# EAGLE board MusselGapeTracker_RevB (EAGLE 7.5.0), part 1 of 2
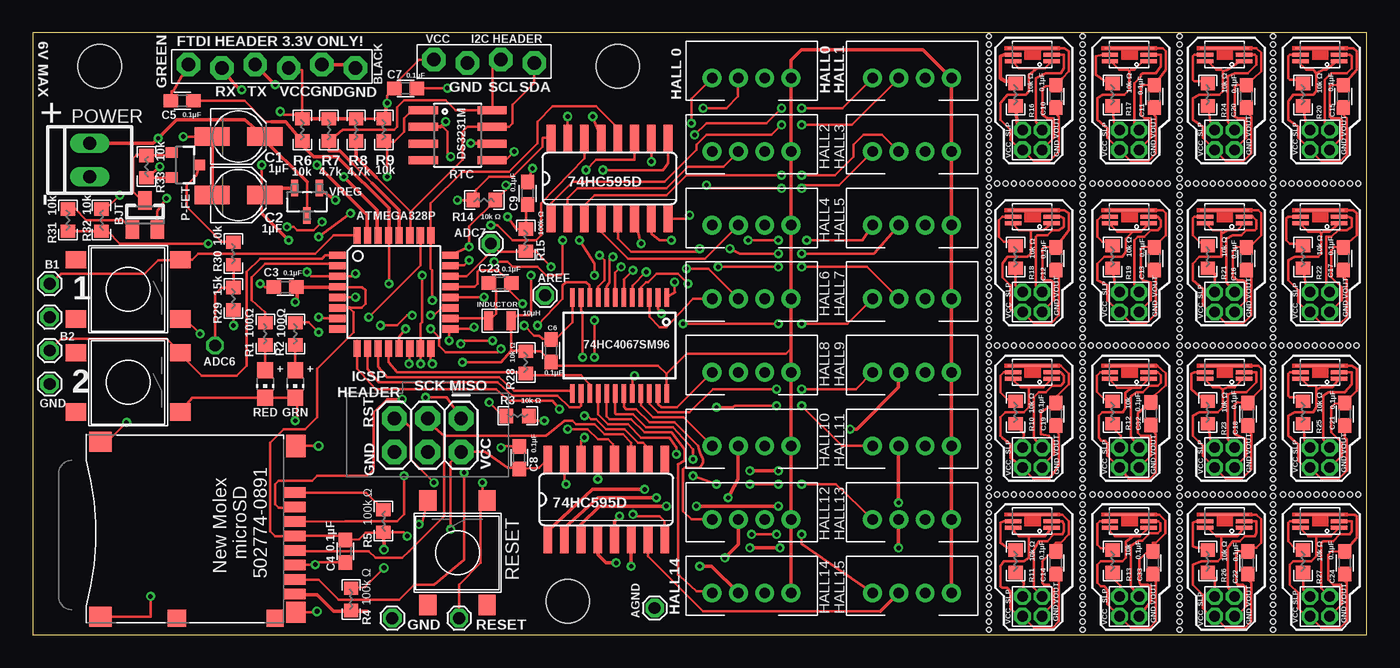
[diagram p1: board, top side]
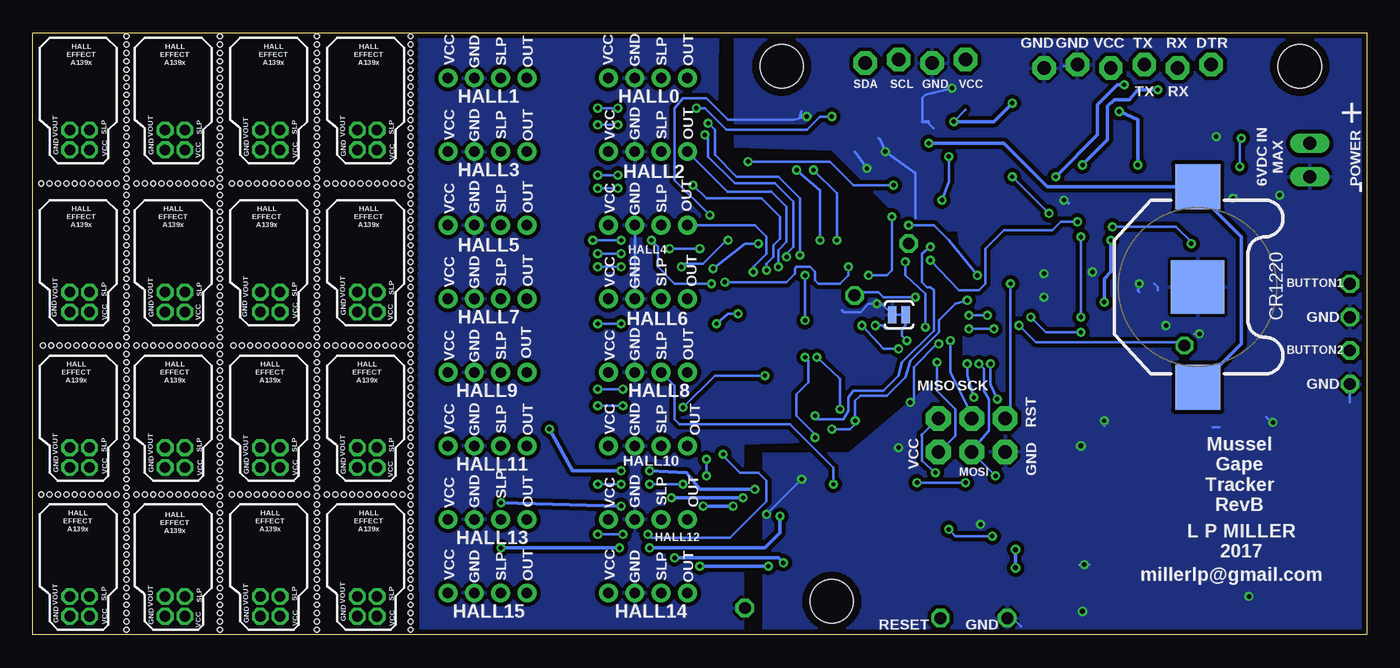
[diagram p2: board, bottom side, seen from below]

Size 101.35 x 45.72 mm. Coordinates in mm from the lower left corner, seen from the top.
Outline: 0,0 101.35,0 101.35,45.72 0,45.72 0,0
Copper layers (1*16): Top 0.0356mm / dielectric 1.5011mm / Bottom 0.0356mm
Design rules "LaenPCBOrder *": minimum track width 6mil, minimum drill 13mil, track to track 6mil, track to pad 6mil, pad to pad 6mil, via to via 6mil, smd to smd 6mil, copper to edge 15mil, drill to drill 6mil, minimum pad ring 7mil, minimum via ring 7mil, stop-mask expansion 3mil, vias tented up to drill 30mil, thermal gap 10mil
Holes 0.38 mm at 72.64,0.38 72.64,1.02 72.64,1.65 72.64,2.29 72.64,2.92 72.64,3.56 72.64,4.19 72.64,4.83 72.64,5.46 72.64,6.1 72.64,6.73 72.64,7.37 72.64,8 72.64,8.64 72.64,9.27 72.64,9.91 72.64,10.54 72.64,11.18 72.64,11.81 72.64,12.45 72.64,13.08 72.64,13.72 72.64,14.35 72.64,14.99 72.64,15.62 72.64,16.26 72.64,16.89 72.64,17.53 72.64,18.16 72.64,18.8 72.64,19.43 72.64,20.07 72.64,20.7 72.64,21.34 72.64,21.97 72.64,22.61 72.64,23.24 72.64,23.88 72.64,24.51 72.64,25.15 72.64,25.78 72.64,26.42 72.64,27.05 72.64,27.69 72.64,28.32 72.64,28.96 72.64,29.59 72.64,30.23 72.64,30.86 72.64,31.5 72.64,32.13 72.64,32.77 72.64,33.4 72.64,34.04 72.64,34.67 72.64,35.31 72.64,35.94 72.64,36.58 72.64,37.21 72.64,37.85 72.64,38.48 72.64,39.12 72.64,39.75 72.64,40.39 72.64,41.02 72.64,41.66 72.64,42.29 72.64,42.93 72.64,43.56 72.64,44.2 72.64,44.83 72.64,45.47 78.99,34.29 78.36,34.29 77.72,34.29 77.09,34.29 76.45,34.29 75.82,34.29 75.18,34.29 74.55,34.29 73.91,34.29 73.28,34.29 73.28,10.67 73.91,10.67 74.55,10.67 75.18,10.67 75.82,10.67 76.45,10.67 77.09,10.67 77.72,10.67 73.28,21.97 73.91,21.97 74.55,21.97 75.18,21.97 75.82,21.97 76.45,21.97 77.09,21.97 77.72,21.97 78.36,21.97 78.99,21.97 78.36,10.67 78.99,10.67 79.76,0.38 79.76,1.02 79.76,1.65 79.76,2.29 79.76,2.92 79.76,3.56 79.76,4.19 79.76,4.83 79.76,5.46 79.76,6.1 79.76,6.73 79.76,7.37 79.76,8 79.76,8.64 79.76,9.27 79.76,9.91 79.76,10.54 79.76,11.18 79.76,11.81 79.76,12.45 79.76,13.08 79.76,13.72 79.76,14.35 79.76,14.99 79.76,15.62 79.76,16.26 79.76,16.89 79.76,17.53 79.76,18.16 79.76,18.8 79.76,19.43 79.76,20.07 79.76,20.7 79.76,21.34 79.76,21.97 79.76,22.61 79.76,23.24 79.76,23.88 79.76,24.51 79.76,25.15 79.76,25.78 79.76,26.42 79.76,27.05 79.76,27.69 79.76,28.32 79.76,28.96 79.76,29.59 79.76,30.23 79.76,30.86 79.76,31.5 79.76,32.13 79.76,32.77 79.76,33.4 79.76,34.04 79.76,34.67 79.76,35.31 79.76,35.94 79.76,36.58 79.76,37.21 79.76,37.85 79.76,38.48 79.76,39.12 79.76,39.75 79.76,40.39 79.76,41.02 79.76,41.66 79.76,42.29 79.76,42.93 79.76,43.56 79.76,44.2 79.76,44.83 79.76,45.47 80.52,10.67 81.15,10.67 81.79,10.67 82.42,10.67 83.06,10.67 83.69,10.67 84.33,10.67 84.96,10.67 85.6,10.67 86.23,10.67 80.39,21.97 81.03,21.97 81.66,21.97 82.3,21.97 82.93,21.97 83.57,21.97 84.2,21.97 84.84,21.97 85.47,21.97 86.11,21.97 86.23,34.29 85.6,34.29 84.96,34.29 84.33,34.29 83.69,34.29 83.06,34.29 82.42,34.29 81.79,34.29 81.15,34.29 80.52,34.29 87.12,0.38 87.12,1.02 87.12,1.65 87.12,2.29 87.12,2.92 87.12,3.56 87.12,4.19 87.12,4.83 87.12,5.46 87.12,6.1 87.12,6.73 87.12,7.37 87.12,8 87.12,8.64 87.12,9.27 87.12,9.91 87.12,10.54 87.12,11.18 87.12,11.81 87.12,12.45 87.12,13.08 87.12,13.72 87.12,14.35 87.12,14.99 87.12,15.62 87.12,16.26 87.12,16.89 87.12,17.53 87.12,18.16 87.12,18.8 87.12,19.43 87.12,20.07 87.12,20.7 87.12,21.34 87.12,21.97 87.12,22.61 87.12,23.24 87.12,23.88 87.12,24.51 87.12,25.15 87.12,25.78 87.12,26.42 87.12,27.05 87.12,27.69 87.12,28.32 87.12,28.96 87.12,29.59 87.12,30.23 87.12,30.86 87.12,31.5 87.12,32.13 87.12,32.77 87.12,33.4 87.12,34.04 87.12,34.67 87.12,35.31 87.12,35.94 87.12,36.58 87.12,37.21 87.12,37.85 87.12,38.48 87.12,39.12 87.12,39.75 87.12,40.39 87.12,41.02 87.12,41.66 87.12,42.29 87.12,42.93 87.12,43.56 87.12,44.2 87.12,44.83 87.12,45.47 93.47,34.29 92.84,34.29 92.2,34.29 91.57,34.29 90.93,34.29 90.3,34.29 89.66,34.29 89.03,34.29 88.39,34.29 87.76,34.29 87.76,10.67 88.39,10.67 89.03,10.67 89.66,10.67 90.3,10.67 90.93,10.67 91.57,10.67 92.2,10.67 87.76,21.97 88.39,21.97 89.03,21.97 89.66,21.97 90.3,21.97 90.93,21.97 91.57,21.97 92.2,21.97 92.84,21.97 93.47,21.97 92.84,10.67 93.47,10.67 94.23,0.38 94.23,1.02 94.23,1.65 94.23,2.29 94.23,2.92 94.23,3.56 94.23,4.19 94.23,4.83 94.23,5.46 94.23,6.1 94.23,6.73 94.23,7.37 94.23,8 94.23,8.64 94.23,9.27 94.23,9.91 94.23,10.54 94.23,11.18 94.23,11.81 94.23,12.45 94.23,13.08 94.23,13.72 94.23,14.35 94.23,14.99 94.23,15.62 94.23,16.26 94.23,16.89 94.23,17.53 94.23,18.16 94.23,18.8 94.23,19.43 94.23,20.07 94.23,20.7 94.23,21.34 94.23,21.97 94.23,22.61 94.23,23.24 94.23,23.88 94.23,24.51 94.23,25.15 94.23,25.78 94.23,26.42 94.23,27.05 94.23,27.69 94.23,28.32 94.23,28.96 94.23,29.59 94.23,30.23 94.23,30.86 94.23,31.5 94.23,32.13 94.23,32.77 94.23,33.4 94.23,34.04 94.23,34.67 94.23,35.31 94.23,35.94 94.23,36.58 94.23,37.21 94.23,37.85 94.23,38.48 94.23,39.12 94.23,39.75 94.23,40.39 94.23,41.02 94.23,41.66 94.23,42.29 94.23,42.93 94.23,43.56 94.23,44.2 94.23,44.83 94.23,45.47 95,10.67 95.63,10.67 96.27,10.67 96.9,10.67 97.54,10.67 98.17,10.67 98.81,10.67 99.44,10.67 100.08,10.67 100.71,10.67 94.87,21.97 95.5,21.97 96.14,21.97 96.77,21.97 97.41,21.97 98.04,21.97 98.68,21.97 99.31,21.97 99.95,21.97 100.58,21.97 100.71,34.29 100.08,34.29 99.44,34.29 98.81,34.29 98.17,34.29 97.54,34.29 96.9,34.29 96.27,34.29 95.63,34.29 95,34.29
tRestrict: area 51.6,40.4 to 53.3,42.2; area 51.6,28.4 to 53.3,30.2

## Footprints (pad centres in the part's own frame; a part is rotated, then mirrored left to right if it is on the bottom)
PUSHBUTTON_DPST_SMD = smd 1.55 x 1.3: P 3.975,-2.25; P$1 -3.975,-2.25; S 3.975,2.25; S$1 -3.975,2.25
A139*_HALL_EFFECT = smd 0.3 x 1.25: P$1 -0.5,-1.475; P$2 0,-1.475; P$5 0,1.475; P$6 -0.5,1.475 | smd 0.15 x 3.7: P$3_4 0.5,0
SOT23 = smd 1 x 1.4: 1 -0.95,-1.1; 2 0.95,-1.1; 3 0,1.1
PANASONIC_B = smd 2.667 x 1.4: + 2.006,0; - -2.006,0
0603 = smd 1.1 x 1: 1 -0.85,0; 2 0.85,0
CR1220_BATTERY_HOLDER_SMD = smd 4.064 x 4.064: GND 0,0 | smd 3.429 x 3.429: P$1 -7.62,0; P$2 7.62,0
DS3231M_SOIC8 = smd 0.61 x 2.21: 1 -1.905,-2.616; 2 -0.635,-2.616; 3 0.635,-2.616; 4 1.905,-2.616; 5 1.905,2.616; 6 0.635,2.616; 7 -0.635,2.616; 8 -1.905,2.616
SJ_2S-TRACE = smd 0.635 x 1.27: 1 -0.508,0; 2 0.508,0
JST-PH-4-THM = drill 0.8 pad 1.422: 1 3,0; 2 1,0; 3 -1,0; 4 -3,0
2X2_1.5MM = drill 0.8 pad 1.27 octagon: P$1 -0.75,0.75; P$2 0.75,0.75; P$3 -0.75,-0.75; P$4 0.75,-0.75
1X04_BIGLOCK = drill 1.016 pad 1.778 octagon: 1 -3.81,0.127; 2 -1.27,-0.127; 3 1.27,0.127; 4 3.81,-0.127
I_0805 = smd 0.7 x 1.45: P$1 -0.85,0; P$2 0.85,0
2X3 = drill 1.016 pad 1.88 octagon: 1 -2.54,0; 2 -2.54,2.54; 3 0,0; 4 0,2.54; 5 2.54,0; 6 2.54,2.54
1X06-BIGLOCK = drill 1.016 pad 1.778 octagon: 1 -6.35,0.127; 2 -3.81,-0.127; 3 -1.27,0.127; 4 1.27,-0.127; 5 3.81,0.127; 6 6.35,-0.127
CHIPLED_0805 = smd 1.2 x 1.2: A 0,-1.05; C 0,1.05
SOT95P237X112-3N = smd 0.559 x 1.27: 1 -0.94,-1.041; 2 0.94,-1.041; 3 0,1.041
SOT23-3 = smd 0.8 x 0.9: 1 -0.95,-1; 2 0.95,-1; 3 0,1.1
R0603 = smd 1 x 1.1: 1 -0.85,0; 2 0.85,0
SO16 = smd 0.66 x 2.032: 1 -4.445,-3.073; 2 -3.175,-3.073; 3 -1.905,-3.073; 4 -0.635,-3.073; 5 0.635,-3.073; 6 1.905,-3.073; 7 3.175,-3.073; 8 4.445,-3.073; 9 4.445,3.073; 10 3.175,3.073; 11 1.905,3.073; 12 0.635,3.073; 13 -0.635,3.073; 14 -1.905,3.073; 15 -3.175,3.073; 16 -4.445,3.073
STAND-OFF = hole 3.302: 0,0
TQFP32-08 = smd 1.27 x 0.559: 1 -4.293,2.8; 2 -4.293,2; 3 -4.293,1.2; 4 -4.293,0.4; 5 -4.293,-0.4; 6 -4.293,-1.2; 7 -4.293,-2; 8 -4.293,-2.8; 17 4.293,-2.8; 18 4.293,-2; 19 4.293,-1.2; 20 4.293,-0.4; 21 4.293,0.4; 22 4.293,1.2; 23 4.293,2; 24 4.293,2.8 | smd 0.559 x 1.27: 9 -2.8,-4.293; 10 -2,-4.293; 11 -1.2,-4.293; 12 -0.4,-4.293; 13 0.4,-4.293; 14 1.2,-4.293; 15 2,-4.293; 16 2.8,-4.293; 25 2.8,4.293; 26 2,4.293; 27 1.2,4.293; 28 0.4,4.293; 29 -0.4,4.293; 30 -1.2,4.293; 31 -2,4.293; 32 -2.8,4.293
MICROSD_SOCKET_MOLEX_REVERSEMOUNT = smd 1.29 x 1.4: CARD_DETECT1 -0.645,8.12 | smd 1.29 x 1.3: CARD_DETECT2 -0.645,0.65 | smd 0.8 x 1.68: CS2 7.8,-0.84; GND6 3.4,-0.84; MISO7 2.3,-0.84; MOSI3 6.7,-0.84; NC1 8.9,-0.84; RES8 1.2,-0.84; SCK5 4.5,-0.84; VDD4 5.6,-0.84 | smd 1.6 x 1.5: MNT1 -0.2,-0.93 | smd 1.7 x 1.5: MNT2 12.45,-0.93 | smd 1.5 x 1.7: MNT3 -0.54,13.92; MNT4 12.75,13.92
SSOP24 = smd 0.348 x 1.397: 1 -3.575,-3.656; 2 -2.925,-3.656; 3 -2.275,-3.656; 4 -1.625,-3.656; 5 -0.975,-3.656; 6 -0.325,-3.656; 7 0.325,-3.656; 8 0.975,-3.656; 9 1.625,-3.656; 10 2.275,-3.656; 11 2.925,-3.656; 12 3.575,-3.656; 13 3.575,3.656; 14 2.925,3.656; 15 2.275,3.656; 16 1.625,3.656; 17 0.975,3.656; 18 0.325,3.656; 19 -0.325,3.656; 20 -0.975,3.656; 21 -1.625,3.656; 22 -2.275,3.656; 23 -2.925,3.656; 24 -3.575,3.656
1X01_SMALL = drill 0.9 pad 1.397 octagon: 1 0,0
22-23-2021 = drill 1 long: 1 -1.27,0; 2 1.27,0

## Placement (x,y rotation side)
1  PUSHBUTTON_DPST_SMDSTANDARD  [PUSHBUTTON_DPST_SMD]  7.24,26.24 180 top
2  PUSHBUTTON_DPST_SMDSTANDARD  [PUSHBUTTON_DPST_SMD]  7.24,19.18 180 top
A139_HALL0  HALL_EFFECT_ALLEGRO_A139MLP/DFN-6  [A139*_HALL_EFFECT]  75.95,44.07 90 top
A139_HALL1  HALL_EFFECT_ALLEGRO_A139MLP/DFN-6  [A139*_HALL_EFFECT]  75.95,8.64 90 top
A139_HALL2  HALL_EFFECT_ALLEGRO_A139MLP/DFN-6  [A139*_HALL_EFFECT]  75.95,19.94 90 top
A139_HALL3  HALL_EFFECT_ALLEGRO_A139MLP/DFN-6  [A139*_HALL_EFFECT]  83.31,19.94 90 top
A139_HALL4  HALL_EFFECT_ALLEGRO_A139MLP/DFN-6  [A139*_HALL_EFFECT]  83.31,8.64 90 top
A139_HALL5  HALL_EFFECT_ALLEGRO_A139MLP/DFN-6  [A139*_HALL_EFFECT]  83.31,44.07 90 top
A139_HALL6  HALL_EFFECT_ALLEGRO_A139MLP/DFN-6  [A139*_HALL_EFFECT]  75.95,31.75 90 top
A139_HALL7  HALL_EFFECT_ALLEGRO_A139MLP/DFN-6  [A139*_HALL_EFFECT]  83.31,31.75 90 top
A139_HALL8  HALL_EFFECT_ALLEGRO_A139MLP/DFN-6  [A139*_HALL_EFFECT]  90.55,44.07 90 top
A139_HALL9  HALL_EFFECT_ALLEGRO_A139MLP/DFN-6  [A139*_HALL_EFFECT]  97.79,44.07 90 top
A139_HALL10  HALL_EFFECT_ALLEGRO_A139MLP/DFN-6  [A139*_HALL_EFFECT]  90.55,31.75 90 top
A139_HALL11  HALL_EFFECT_ALLEGRO_A139MLP/DFN-6  [A139*_HALL_EFFECT]  97.79,31.75 90 top
A139_HALL12  HALL_EFFECT_ALLEGRO_A139MLP/DFN-6  [A139*_HALL_EFFECT]  90.55,19.94 90 top
A139_HALL13  HALL_EFFECT_ALLEGRO_A139MLP/DFN-6  [A139*_HALL_EFFECT]  97.79,19.94 90 top
A139_HALL14  HALL_EFFECT_ALLEGRO_A139MLP/DFN-6  [A139*_HALL_EFFECT]  90.55,8.64 90 top
A139_HALL15  HALL_EFFECT_ALLEGRO_A139MLP/DFN-6  [A139*_HALL_EFFECT]  97.79,8.64 90 top
BJT  KSC1623_BJT_TRANSISTOR  [SOT23]  8.51,31.88 0 top
C1  1µF  [PANASONIC_B]  15.62,37.85 0 top
C2  1µF  [PANASONIC_B]  15.62,33.4 0 top
C3  0.1µF  [0603]  19.18,26.42 180 top
C4  0.1µF  [0603]  23.75,6.35 270 top
C5  0.1µF  [0603]  11.35,40.56 0 top
C6  0.1µF  [0603]  39.37,21.59 90 top
C7  0.1µF  [0603]  28.32,41.5 0 top
C8  0.1µF  [0603]  36.96,13.46 90 top
C9  0.1µF  [0603]  37.59,33.53 90 top
C10  0.1µF  [0603]  77.72,40.89 90 top
C11  0.1µF  [0603]  85.22,40.89 90 top
C12  0.1µF  [0603]  77.72,28.57 90 top
C13  0.1µF  [0603]  85.22,28.57 90 top
C14  0.1µF  [0603]  77.72,5.46 90 top
C15  0.1µF  [0603]  99.57,40.89 90 top
C16  0.1µF  [0603]  92.2,28.57 90 top
C17  0.1µF  [0603]  99.57,28.57 90 top
C18  0.1µF  [0603]  92.33,16.76 90 top
C19  0.1µF  [0603]  77.72,16.76 90 top
C20  0.1µF  [0603]  92.2,40.89 90 top
C21  0.1µF  [0603]  99.69,16.76 90 top
C22  0.1µF  [0603]  92.33,5.46 90 top
C23  0.1µF  [0603]  35.51,26.72 0 top
C24  0.1µF  [0603]  99.69,5.46 90 top
C32  0.1µF  [0603]  84.96,16.79 90 top
C33  0.1µF  [0603]  85.09,5.46 90 top
CR1220_BATTERY  CR1220_BATTERY_HOLDERSMD  [CR1220_BATTERY_HOLDER_SMD]  12.83,26.42 270 bottom
DS3231M  DS3231MSOIC-8  [DS3231M_SOIC8]  32.28,37.95 270 top
GROUND_CON  SOLDER_JUMPER_TRACESTANDARD  [SJ_2S-TRACE]  35.53,24.31 180 bottom
HALL0  JST-4PINTH_STRAIGHT  [JST-PH-4-THM]  54.61,42.29 0 top
HALL0_HEADER  PINHD-2X21.5MM_SILK  [2X2_1.5MM]  75.95,37.59 180 top
HALL1  JST-4PINTH_STRAIGHT  [JST-PH-4-THM]  66.8,42.29 0 top
HALL1_HEADER  PINHD-2X21.5MM_SILK  [2X2_1.5MM]  75.95,2.16 180 top
HALL2  JST-4PINTH_STRAIGHT  [JST-PH-4-THM]  54.61,36.7 0 top
HALL2_HEADER  PINHD-2X21.5MM_SILK  [2X2_1.5MM]  75.95,13.46 180 top
HALL3  JST-4PINTH_STRAIGHT  [JST-PH-4-THM]  66.8,36.7 0 top
HALL3_HEADER  PINHD-2X21.5MM_SILK  [2X2_1.5MM]  83.31,13.46 180 top
HALL4  JST-4PINTH_STRAIGHT  [JST-PH-4-THM]  54.61,31.11 0 top
HALL4_HEADER  PINHD-2X21.5MM_SILK  [2X2_1.5MM]  83.31,2.16 180 top
HALL5  JST-4PINTH_STRAIGHT  [JST-PH-4-THM]  66.8,31.11 0 top
HALL5_HEADER  PINHD-2X21.5MM_SILK  [2X2_1.5MM]  83.31,37.59 180 top
HALL6  JST-4PINTH_STRAIGHT  [JST-PH-4-THM]  54.61,25.53 0 top
HALL6_HEADER  PINHD-2X21.5MM_SILK  [2X2_1.5MM]  75.95,25.27 180 top
HALL7  JST-4PINTH_STRAIGHT  [JST-PH-4-THM]  66.8,25.53 0 top
HALL7_HEADER  PINHD-2X21.5MM_SILK  [2X2_1.5MM]  83.31,25.27 180 top
HALL8  JST-4PINTH_STRAIGHT  [JST-PH-4-THM]  54.61,19.94 0 top
HALL8_HEADER  PINHD-2X21.5MM_SILK  [2X2_1.5MM]  90.55,37.59 180 top
HALL9  JST-4PINTH_STRAIGHT  [JST-PH-4-THM]  66.8,19.94 0 top
HALL9_HEADER  PINHD-2X21.5MM_SILK  [2X2_1.5MM]  97.79,37.59 180 top
HALL10  JST-4PINTH_STRAIGHT  [JST-PH-4-THM]  54.61,14.35 0 top
HALL10_HEADER  PINHD-2X21.5MM_SILK  [2X2_1.5MM]  90.55,25.27 180 top
HALL11  JST-4PINTH_STRAIGHT  [JST-PH-4-THM]  66.8,14.35 0 top
HALL11_HEADER  PINHD-2X21.5MM_SILK  [2X2_1.5MM]  97.79,25.27 180 top
HALL12  JST-4PINTH_STRAIGHT  [JST-PH-4-THM]  54.61,8.76 0 top
HALL12_HEADER  PINHD-2X21.5MM_SILK  [2X2_1.5MM]  90.55,13.46 180 top
HALL13  JST-4PINTH_STRAIGHT  [JST-PH-4-THM]  66.8,8.76 0 top
HALL13_HEADER  PINHD-2X21.5MM_SILK  [2X2_1.5MM]  97.79,13.46 180 top
HALL14  JST-4PINTH_STRAIGHT  [JST-PH-4-THM]  54.61,3.17 0 top
HALL14_HEADER  PINHD-2X21.5MM_SILK  [2X2_1.5MM]  90.55,2.16 180 top
HALL15  JST-4PINTH_STRAIGHT  [JST-PH-4-THM]  66.8,3.17 0 top
HALL15_HEADER  PINHD-2X21.5MM_SILK  [2X2_1.5MM]  97.79,2.16 180 top
I2C_HEADER  PINHD-1X4BIG_LOCK  [1X04_BIGLOCK]  34.29,43.56 0 top
INDUCTOR  10µH  [I_0805]  35.48,23.85 0 top
J1  AVR_SPI_PRG_6PTH  [2X3]  30,16.43 180 top
JP1  FTDI_HEADER  [1X06-BIGLOCK]  18.16,43.18 180 top
LED1  RED_LED  [CHIPLED_0805]  17.65,19.05 180 top
LED2  GREEN_LED  [CHIPLED_0805]  19.94,19.05 180 top
MCP1700T-3302  MCP1700T-3302E/TT  [SOT95P237X112-3N]  20.83,32.89 180 top
P-FET  MOSFET-PCHANNELBSH203  [SOT23-3]  11.56,35.69 270 top
R1  100 Ω  [R0603]  17.65,22.86 90 top
R2  100 Ω  [R0603]  19.94,22.86 90 top
R3  10k Ω  [R0603]  36.83,16.64 0 top
R4  100k Ω  [R0603]  24.18,2.69 90 top
R5  100k Ω  [R0603]  26.64,8.64 270 top
R6  10k Ω  [R0603]  20.47,38.35 90 top
R7  10k Ω  [R0603]  22.5,38.35 90 top
R8  10k Ω  [R0603]  24.56,38.35 90 top
R9  10k Ω  [R0603]  26.67,38.35 90 top
R10  10k Ω  [R0603]  74.68,16.89 90 top
R11  10k Ω  [R0603]  74.68,5.59 90 top
R12  10k Ω  [R0603]  82.04,16.89 90 top
R13  10k Ω  [R0603]  82.04,5.59 90 top
R14  10k Ω  [R0603]  34.29,33.02 180 top
R15  100k Ω  [R0603]  37.47,29.97 90 top
R16  10k Ω  [R0603]  74.68,41.02 90 top
R17  10k Ω  [R0603]  82.04,41.02 90 top
R18  10k Ω  [R0603]  74.68,28.7 90 top
R19  10k Ω  [R0603]  82.04,28.7 90 top
R20  10k Ω  [R0603]  96.52,41.02 90 top
R21  10k Ω  [R0603]  89.28,28.7 90 top
R22  10k Ω  [R0603]  96.52,28.7 90 top
R23  10k Ω  [R0603]  89.28,16.89 90 top
R24  10k Ω  [R0603]  89.28,41.02 90 top
R25  10k Ω  [R0603]  96.52,16.89 90 top
R26  10k Ω  [R0603]  89.28,5.59 90 top
R27  10k Ω  [R0603]  96.52,5.59 90 top
R28  10k Ω  [R0603]  37.47,20.7 90 top
R29  15k  [R0603]  15.24,25.53 90 top
R30  10k  [R0603]  15.24,28.96 90 top
R31  10k  [R0603]  2.67,31.5 90 top
R32  10k  [R0603]  5.21,31.5 270 top
R33  10k  [R0603]  8.64,35.56 270 top
RESET  PUSHBUTTON_DPST_SMDSTANDARD  [PUSHBUTTON_DPST_SMD]  32.26,6.22 270 top
SHIFT_0  74HC595D  [SO16]  43.81,34.67 0 top
SHIFT_1  74HC595D  [SO16]  43.56,10.29 0 top
STANDOFF1  STAND-OFF  [STAND-OFF]  44.45,43.18 0 top
STANDOFF2  STAND-OFF  [STAND-OFF]  5.08,43.18 0 top
STANDOFF3  STAND-OFF  [STAND-OFF]  40.64,2.54 0 top
U1  ATMEGA328P  [TQFP32-08]  27.43,26.04 0 top
U$1  MICROSD_MOLEX_REVERSECURRENT  [MICROSD_SOCKET_MOLEX_REVERSEMOUNT]  19.05,1.91 90 top
U$2  74HC4067SM96  [SSOP24]  44.58,21.97 180 top
U$3  PINHD-1X1SMALL  [1X01_SMALL]  32.38,1.27 0 top
U$4  PINHD-1X1SMALL  [1X01_SMALL]  27.3,1.27 0 top
U$6  PINHD-1X1SMALL  [1X01_SMALL]  1.27,26.67 0 top
U$7  PINHD-1X1SMALL  [1X01_SMALL]  1.27,24.13 0 top
U$8  PINHD-1X1SMALL  [1X01_SMALL]  1.27,21.59 0 top
U$9  PINHD-1X1SMALL  [1X01_SMALL]  1.27,19.05 0 top
U$10  PINHD-1X1SMALL  [1X01_SMALL]  34.8,29.72 0 top
U$11  PINHD-1X1SMALL  [1X01_SMALL]  47.24,2.03 0 top
U$17  PINHD-1X1SMALL  [1X01_SMALL]  38.91,25.78 0 top
X1  22-23-2021  [22-23-2021]  4.32,36.07 90 top